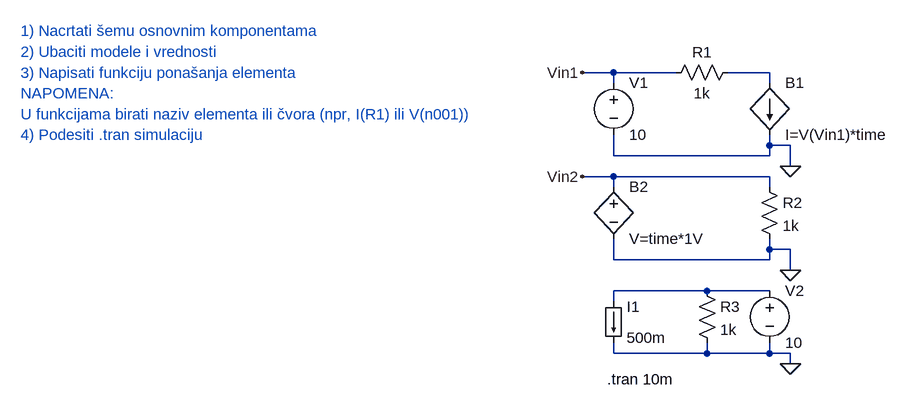
[diagram p0: schematic V4_Proizvoljne_funkcije.asc]
V4_Proizvoljne_funkcije.asc, the LTspice schematic file:
Version 4
SHEET 1 880 680
WIRE -48 128 -96 128
WIRE 48 128 -48 128
WIRE 192 128 128 128
WIRE -48 144 -48 128
WIRE 192 144 192 128
WIRE 192 240 192 224
WIRE 224 240 192 240
WIRE -48 256 -48 224
WIRE 192 256 192 240
WIRE 192 256 -48 256
WIRE 224 272 224 240
WIRE -48 288 -96 288
WIRE 192 288 -48 288
WIRE -48 304 -48 288
WIRE 192 304 192 288
WIRE 192 400 192 384
WIRE 224 400 192 400
WIRE -48 416 -48 384
WIRE 192 416 192 400
WIRE 192 416 -48 416
WIRE 224 432 224 400
WIRE 96 464 -48 464
WIRE 192 464 96 464
WIRE -48 480 -48 464
WIRE -48 560 -48 544
WIRE 96 560 96 544
WIRE 96 560 -48 560
WIRE 192 560 192 544
WIRE 192 560 96 560
WIRE 224 560 192 560
WIRE 224 576 224 560
FLAG 224 272 0
FLAG 224 432 0
FLAG -96 288 Vin2
FLAG 224 576 0
FLAG -96 128 Vin1
SYMBOL voltage -48 128 R0
WINDOW 123 0 0 Left 0
WINDOW 39 0 0 Left 0
SYMATTR InstName V1
SYMATTR Value 10
SYMBOL res 144 112 R90
WINDOW 0 0 56 VBottom 2
WINDOW 3 32 56 VTop 2
SYMATTR InstName R1
SYMATTR Value 1k
SYMBOL bi 192 144 R0
SYMATTR InstName B1
SYMATTR Value I=V(Vin1)*time
SYMBOL bv -48 288 R0
SYMATTR InstName B2
SYMATTR Value V=time*1V
SYMBOL res 176 288 R0
SYMATTR InstName R2
SYMATTR Value 1k
SYMBOL load -64 480 R0
WINDOW 123 0 0 Left 0
WINDOW 39 0 0 Left 0
SYMATTR InstName I1
SYMATTR Value 500m
SYMBOL res 80 448 R0
SYMATTR InstName R3
SYMATTR Value 1k
SYMBOL voltage 192 448 R0
WINDOW 123 0 0 Left 0
WINDOW 39 0 0 Left 0
SYMATTR InstName V2
SYMATTR Value 10
TEXT -960 64 Left 2 ;1) Nacrtati šemu osnovnim komponentama
TEXT -960 96 Left 2 ;2) Ubaciti modele i vrednosti
TEXT -960 224 Left 2 ;4) Podesiti .tran simulaciju
TEXT -58 600 Left 2 !.tran 10m
TEXT -960 128 Left 2 ;3) Napisati funkciju ponašanja elementa
TEXT -960 160 Left 2 ;NAPOMENA:
TEXT -960 192 Left 2 ;U funkcijama birati naziv elementa ili čvora (npr, I(R1) ili V(n001))

The netlist it stands for:
* V4_Proizvoljne_funkcije.asc
V1 Vin1 0 10
R1 N001 Vin1 1k
B1 N001 0 I=V(Vin1)*time
B2 Vin2 0 V=time*1V
R2 Vin2 0 1k
I1 N002 0 500m
R3 N002 0 1k
V2 N002 0 10
* 1) Nacrtati šemu osnovnim komponentama
* 2) Ubaciti modele i vrednosti
* 4) Podesiti .tran simulaciju
.tran 10m
* 3) Napisati funkciju ponašanja elementa
* NAPOMENA:
* U funkcijama birati naziv elementa ili čvora (npr, I(R1) ili V(n001))
.backanno
.end